# Altium schematic sheet 14_PoE_USB_PD.SchDoc: PoE and USB PD (part 1 of 3)
size A3; Organization: Lime Microsystems; Address1: Surrey Tech Centre; Address2: Guildford GU2 7YG; Address3: Surrey; Address4: United Kingdom; Revision: v1.3; SheetNumber: 12; SheetTotal: 13
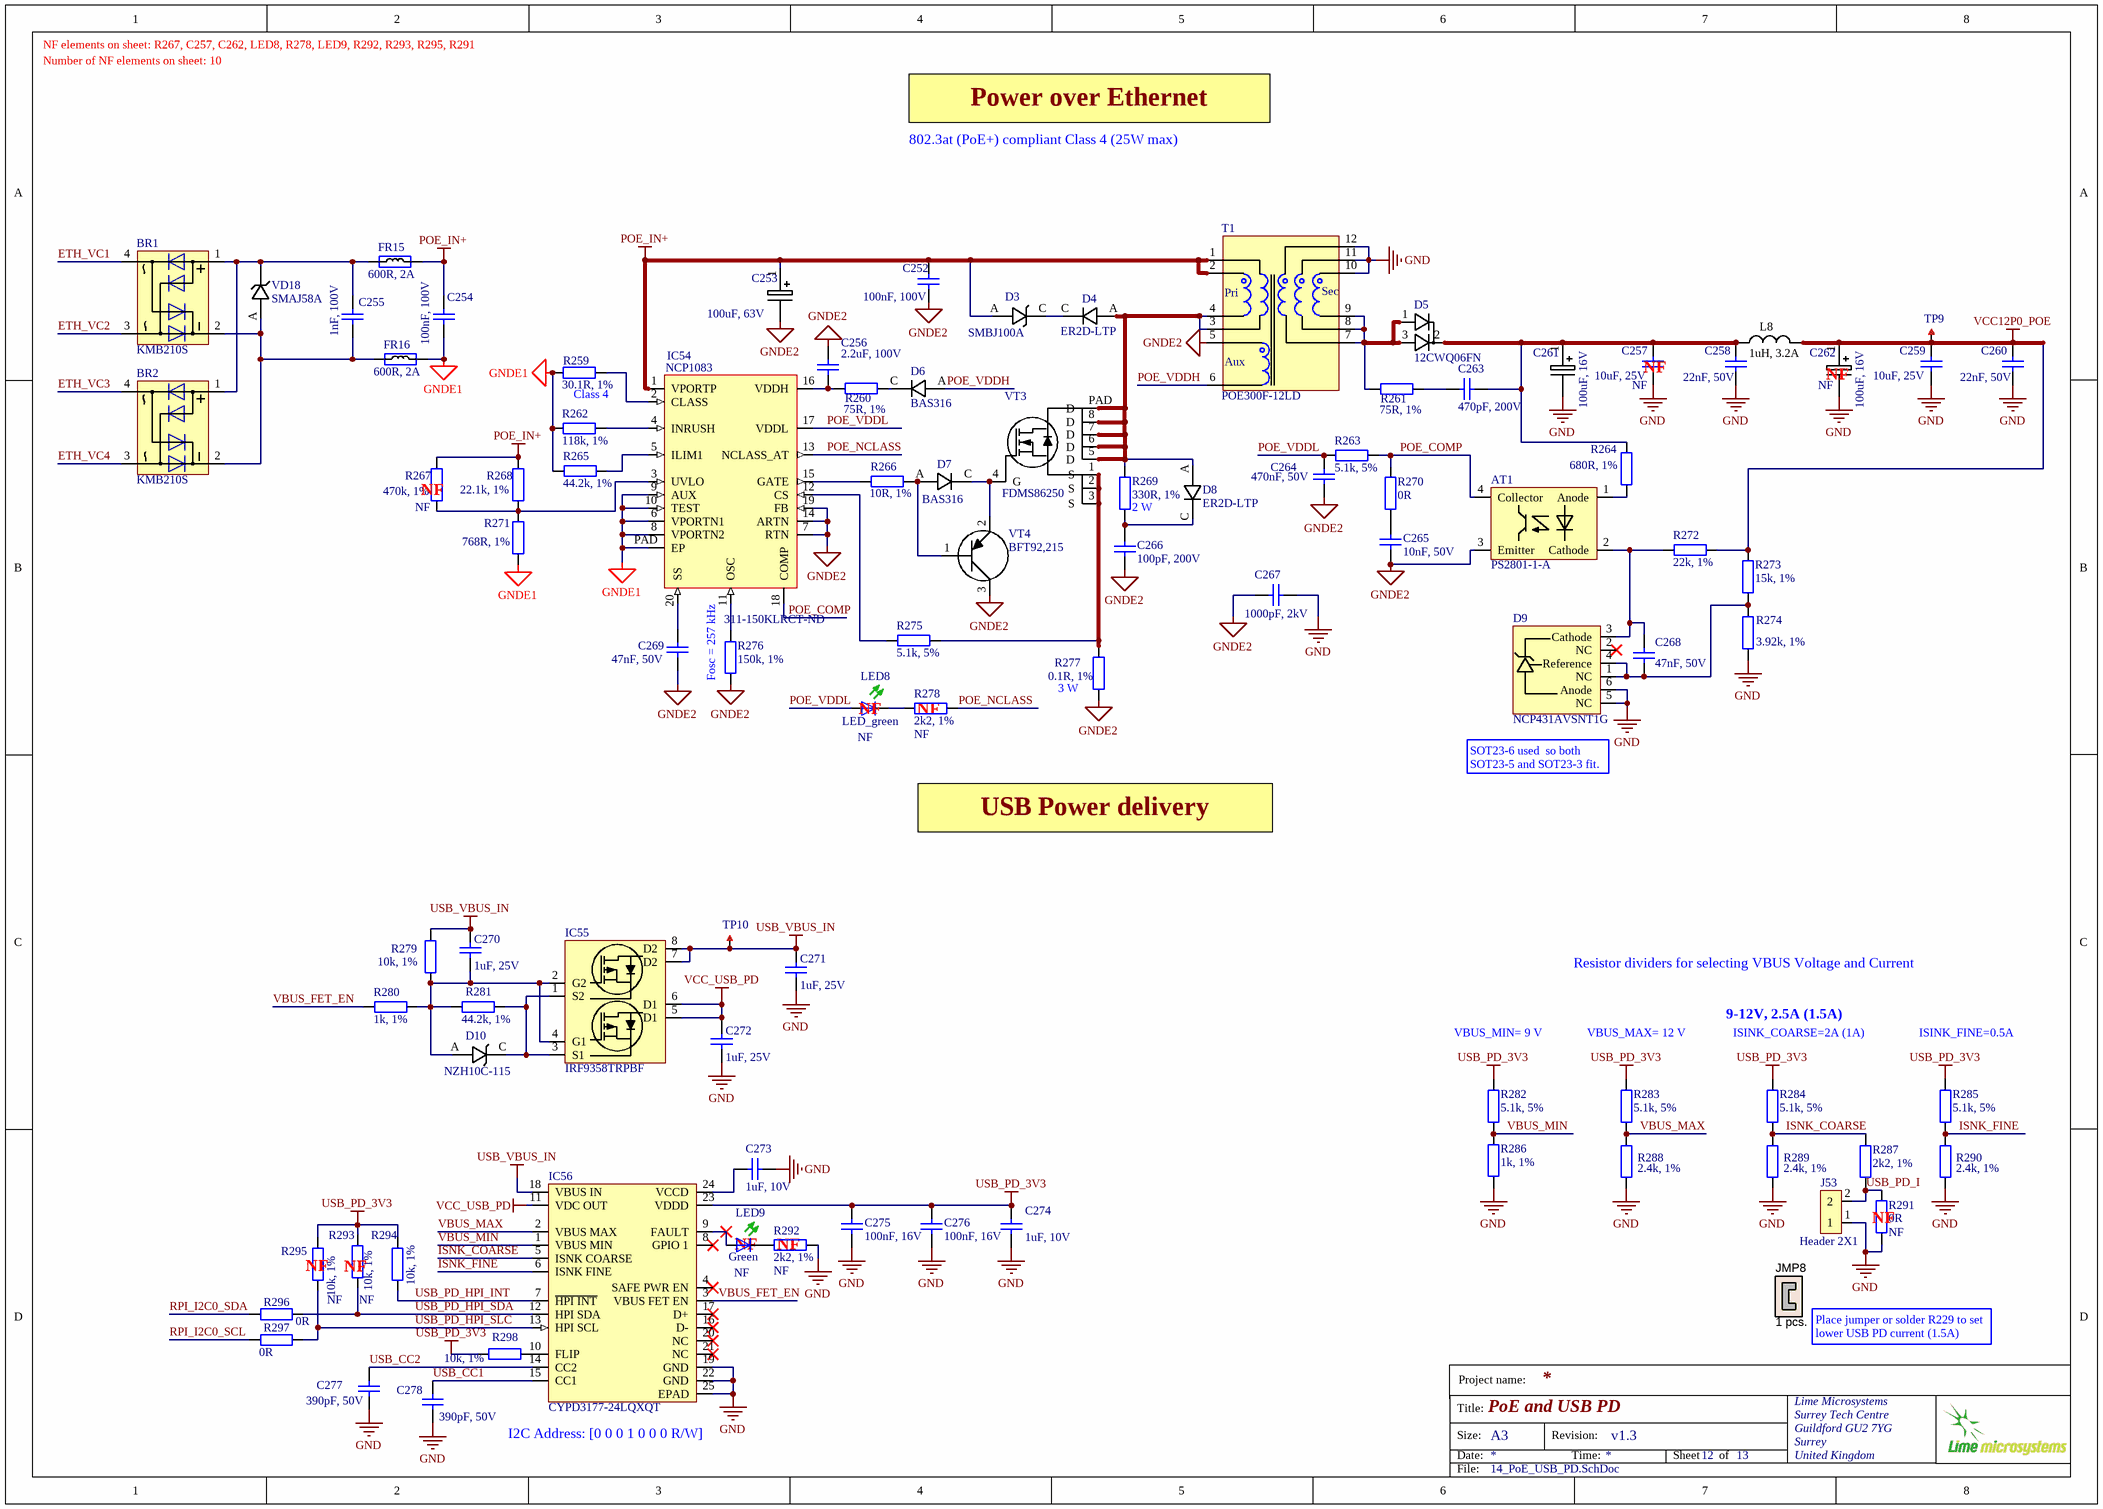
[diagram p0: 14_PoE_USB_PD.SchDoc]

## Parts
AT1  PS2801-1-A  [TCMT1107CT_optoisolator]
BR1  KMB210S  [KMB210S_RECTIFIER_BRIDGE]
BR2  KMB210S  [KMB210S_RECTIFIER_BRIDGE]
C252  100nF, 100V  [CAP0603]
C253  100uF, 63V  [CAP_POL_D10_H10]
C254  100nF, 100V  [CAP0603]
C255  1nF, 100V  [CAP0603]
C256  2.2uF, 100V  [CAP1206]
C257  10uF, 25V  Assembly Info: NF  [CAP0805]
C258  22nF, 50V  [CAP0402]
C259  10uF, 25V  [CAP0805]
C260  22nF, 50V  [CAP0402]
C261  100uF, 16V  [CAP_POL_SIZE_F_v2]
C262  100uF, 16V  Assembly Info: NF  [CAP_POL_SIZE_F_v2]
C263  470pF, 200V  [CAP0603]
C264  470nF, 50V  [CAP0603]
C265  10nF, 50V  [CAP0402]
C266  100pF, 200V  [CAP0603]
C267  1000pF, 2kV  [CAP1812]
C268  47nF, 50V  [CAP0603]
C269  47nF, 50V  [CAP0603]
C270  1uF, 25V  [CAP0603]
C271  1uF, 25V  [CAP0603]
C272  1uF, 25V  [CAP0603]
C273  1uF, 10V  [CAP0402]
C274  1uF, 10V  [CAP0402]
C275  100nF, 16V  [CAP0402]
C276  100nF, 16V  [CAP0402]
C277  390pF, 50V  [CAP0402]
C278  390pF, 50V  [CAP0402]
D3  SMBJ100A  [SMBJ100A_DIODE_DO-214AA]
D4  ER2D-LTP  [ER2D-LTP_DIODE_DO-214AA]
D5  12CWQ06FN  [12CWQ06FN_diode_array_DPAK]
D6  BAS316  [BAS316_DIODE_SOD323]
D7  BAS316  [BAS316_DIODE_SOD323]
D8  ER2D-LTP  [ER2D-LTP_DIODE_DO-214AA]
D9  NCP431AVSNT1G  [SOT23-6]
D10  NZH10C-115  [NZH10C,115_shottky_diode_SOD123]
FR15  600R, 2A  [RES0805]
FR16  600R, 2A  [RES0805]
IC54  NCP1083  [NCP1083_PoE_controller_TSSOP20]
IC55  IRF9358TRPBF  [IRF9358TRPBF_DUAL_NMOS_SOIC8]
IC56  CYPD3177-24LQXQT  [USB_POWER_DISTR_CYPD3177_QFN24]
J53  Header 2X1  [HDR_1x2]
JMP8  1 pcs.  (mechanical)
L8  1uH, 3.2A  [NRS4018T3R3MDGJ_inductor]
LED8  LED_green  Assembly Info: NF  [LED-0603-GREEN]
LED9  Green  Assembly Info: NF  [LED-0603-GREEN]
R259  30.1R, 1%  [RES0402]
R260  75R, 1%  [RES0402]
R261  75R, 1%  [RES0402]
R262  118k, 1%  [RES0402]
R263  5.1k, 5%  [RES0402]
R264  680R, 1%  [RES0402]
R265  44.2k, 1%  [RES0402]
R266  10R, 1%  [RES0603]
R267  470k, 1%  Assembly Info: NF  [RES0402]
R268  22.1k, 1%  [RES0402]
R269  330R, 1%  [RES2512]
R270  0R  [RES0402]
R271  768R, 1%  [RES0402]
R272  22k, 1%  [RES0402]
R273  15k, 1%  [RES0402]
R274  3.92k, 1%  [RES0402]
R275  5.1k, 5%  [RES0402]
R276  150k, 1%  Supplier Part Number 1: 311-150KLRCT-ND  [RES0402]
R277  0.1R, 1%  [RES2512]
R278  2k2, 1%  Assembly Info: NF  [RES0402]
R279  10k, 1%  [RES0402]
R280  1k, 1%  [RES0402]
R281  44.2k, 1%  [RES0402]
R282  5.1k, 5%  [RES0402]
R283  5.1k, 5%  [RES0402]
R284  5.1k, 5%  [RES0402]
R285  5.1k, 5%  [RES0402]
R286  1k, 1%  [RES0402]
R287  2k2, 1%  [RES0402]
R288  2.4k, 1%  [RES0402]
R289  2.4k, 1%  [RES0402]
R290  2.4k, 1%  [RES0402]
R291  0R  Assembly Info: NF  [RES0402]
R292  2k2, 1%  Assembly Info: NF  [RES0402]
R293  10k, 1%  Assembly Info: NF  [RES0402]
R294  10k, 1%  [RES0402]
R295  10k, 1%  Assembly Info: NF  [RES0402]
R296  0R  [RES0402]
R297  0R  [RES0402]
R298  10k, 1%  [RES0402]
T1  POE300F-12LD  [POE300F50LD_TRANSFORMER]
TP9  TESTPOINT_PAD  [TP_PAD_1p5MM]  (value not drawn)  (no BOM)
TP10  TESTPOINT_PAD  [TP_PAD_1p5MM]  (value not drawn)  (no BOM)
VD18  SMAJ58A  [SMAJ58A_shottky_diode]
VT3  FDMS86250  [FDMS86250_NMOS_POWER56]
VT4  BFT92,215  [BFT92,215_PNP_STO23-3]

## Nets
GND: C257.1 C258.2 C259.1 C260.2 C261.2 C262.2 C267.1 C271.1 C272.1 C273.1 C274.1 C275.2 C276.2 C277.2 C278.2 D9.5(NC) D9.6(Anode) IC56.19(GND) IC56.22(GND) IC56.25(EPAD) J53.1 R274.2 R286.2 R288.1 R289.1 R290.1 R291.2 R292.2 T1.10 T1.11 T1.12
GNDE1: C254.1 FR16.2 IC54.6(VPORTN1) IC54.8(VPORTN2) IC54.9(AUX) IC54.10(TEST) IC54.PAD(EP) R259.1 R262.1 R265.2 R271.2
GNDE2: AT1.3(Emitter) C252.1 C253.2 C256.2 C264.1 C265.1 C266.2 C267.2 C269.1 IC54.7(RTN) IC54.14(ARTN) IC54.19(FB) R276.1 R277.1 T1.5 VT4.3(C)
POE_IN+: C252.2 C253.1 C254.2 D3.A FR15.2 IC54.1(VPORTP) R267.2 R268.2 T1.1 T1.2
USB_PD_3V3: C274.2 C275.1 C276.1 IC56.23(VDDD) R282.1 R283.1 R284.1 R285.1 R293.2 R294.2 R295.2 R298.1
USB_VBUS_IN: C270.2 C271.2 IC55.7(D2) IC55.8(D2) IC56.18(VBUS_IN) R279.2 TP10.1
VCC12P0_POE: C259.2 C260.1 C262.1 L8.2 R272.1 R273.1 TP9.1
VCC_USB_PD: C272.2 IC55.5(D1) IC55.6(D1) IC56.11(VDC_OUT)
ETH_VC1: BR1.4
ETH_VC2: BR1.3
ETH_VC3: BR2.4
ETH_VC4: BR2.3
ISNK_COARSE: IC56.5(ISNK_COARSE) R284.2 R287.2 R289.2
ISNK_FINE: IC56.6(ISNK_FINE) R285.2 R290.2
POE_COMP: AT1.4(Collector) IC54.18(COMP) R263.1 R270.1
POE_NCLASS: IC54.13(NCLASS_AT) R278.2
POE_VDDH: D6.A T1.6
POE_VDDL: C264.2 IC54.17(VDDL) LED8.A R263.2
RPI_I2C0_SCL: R297.2
RPI_I2C0_SDA: R296.2
USB_CC1: C278.1 IC56.15(CC1)
USB_CC2: C277.1 IC56.14(CC2)
USB_PD_HPI_INT: IC56.7(~{HPI_INT}) R294.1
USB_PD_HPI_SDA: IC56.12(HPI_SDA) R293.1 R296.1
USB_PD_HPI_SLC: IC56.13(HPI_SCL) R295.1 R297.1
USB_PD_I: J53.2 R287.1 R291.1
VBUS_FET_EN: IC56.3(VBUS_FET_EN) R280.2
VBUS_MAX: IC56.2(VBUS_MAX) R283.2 R288.2
VBUS_MIN: IC56.1(VBUS_MIN) R282.2 R286.1
NetAT1_1: AT1.1(Anode) R264.2
NetAT1_2: AT1.2(Cathode) C268.2 D9.3(Cathode) R272.2
NetBR1_1: BR1.1 BR2.1 C255.1 FR15.1 VD18.K
NetBR1_2: BR1.2 BR2.2 C255.2 FR16.1 VD18.A
NetC256_1: C256.1 IC54.16(VDDH) R260.1
NetC257_2: C257.2 C258.1 C261.1 C263.2 D5.2 L8.1 R264.1
NetC263_1: C263.1 R261.2
NetC265_2: C265.2 R270.2
NetC266_1: C266.1 D8.C R269.1
NetC268_1: C268.1 D9.1(NC) D9.4(Reference) R273.2 R274.1
NetC269_2: C269.2 IC54.20(SS)
NetC270_1: C270.1 D10.A IC55.2(G2) IC55.4(G1) R279.1 R280.1 R281.2
NetC273_2: C273.2 IC56.24(VCCD)
NetD3_C: D3.C D4.C
NetD4_A: D4.A D8.A R269.2 T1.3 T1.4 VT3.5(D) VT3.6(D) VT3.7(D) VT3.8(D) VT3.PAD(D)
NetD5_1: D5.1 D5.3 R261.1 T1.7 T1.8 T1.9
NetD6_C: D6.C R260.2
NetD7_A: D7.A R266.1 VT4.1(S)
NetD7_C: D7.C VT3.4(G) VT4.2(E)
NetD10_C: D10.C IC55.1(S2) IC55.3(S1) R281.1
NetIC54_2: IC54.2(CLASS) R259.2
NetIC54_3: IC54.3(UVLO) R267.1 R268.1 R271.1
NetIC54_4: IC54.4(INRUSH) R262.2
NetIC54_5: IC54.5(ILIM1) R265.1
NetIC54_11: IC54.11(OSC) R276.2
NetIC54_12: IC54.12(CS) R275.2
NetIC54_15: IC54.15(GATE) R266.2
NetIC56_9: IC56.9(FAULT) LED9.A
NetIC56_10: IC56.10(FLIP) R298.2
NetLED8_K: LED8.K(C) R278.1
NetLED9_K: LED9.K(C) R292.1
NetR275_1: R275.1 R277.2 VT3.1(S) VT3.2(S) VT3.3(S)

Not connected (* = marked no-connect by the designer): D9 2(NC)*; IC56 4(SAFE_PWR_EN)* 8(GPIO_1)* 16(D-)* 17(D+)* 20(NC)* 21(NC)*; JMP8 1 2

## Notes on the sheet
- NF elements on sheet: R267, C257, C262, LED8, R278, LED9, R292, R293, R295, R291
- Number of NF elements on sheet: 10
- 802.3at (PoE+) compliant Class 4 (25W max)
- Power over Ethernet
- (near C257) NF
- (near C262) NF
- Class 4
- (near R267) NF
- (near R269) 2 W
- Fosc = 257 kHz
- (near LED8) NF
- (near R278) NF
- (near R277) 3 W
- (near D9) SOT23-6 used  so both SOT23-5 and SOT23-3 fit.
- USB Power delivery
- Resistor dividers for selecting VBUS Voltage and Current
- (near R282) VBUS_MIN= 9 V
- (near R283) VBUS_MAX= 12 V
- 9-12V, 2.5A (1.5A)
- (near R284) ISINK_COARSE=2A (1A)
- (near R285) ISINK_FINE=0.5A
- NF
- (near R292) NF
- (near R291) NF
- (near R295) NF
- (near R293) NF
- Place jumper or solder R229 to set lower USB PD current (1.5A)
- (near IC56) I2C Address: [0 0 0 1 0 0 0 R/W]
- Project name:
- Title:
- Size:
- Date:
- A3
- Revision:
- Time:
- Sheet
- of
- File:
- (in symbol POE300F-50LD_transformer) Pri; Sec; Aux